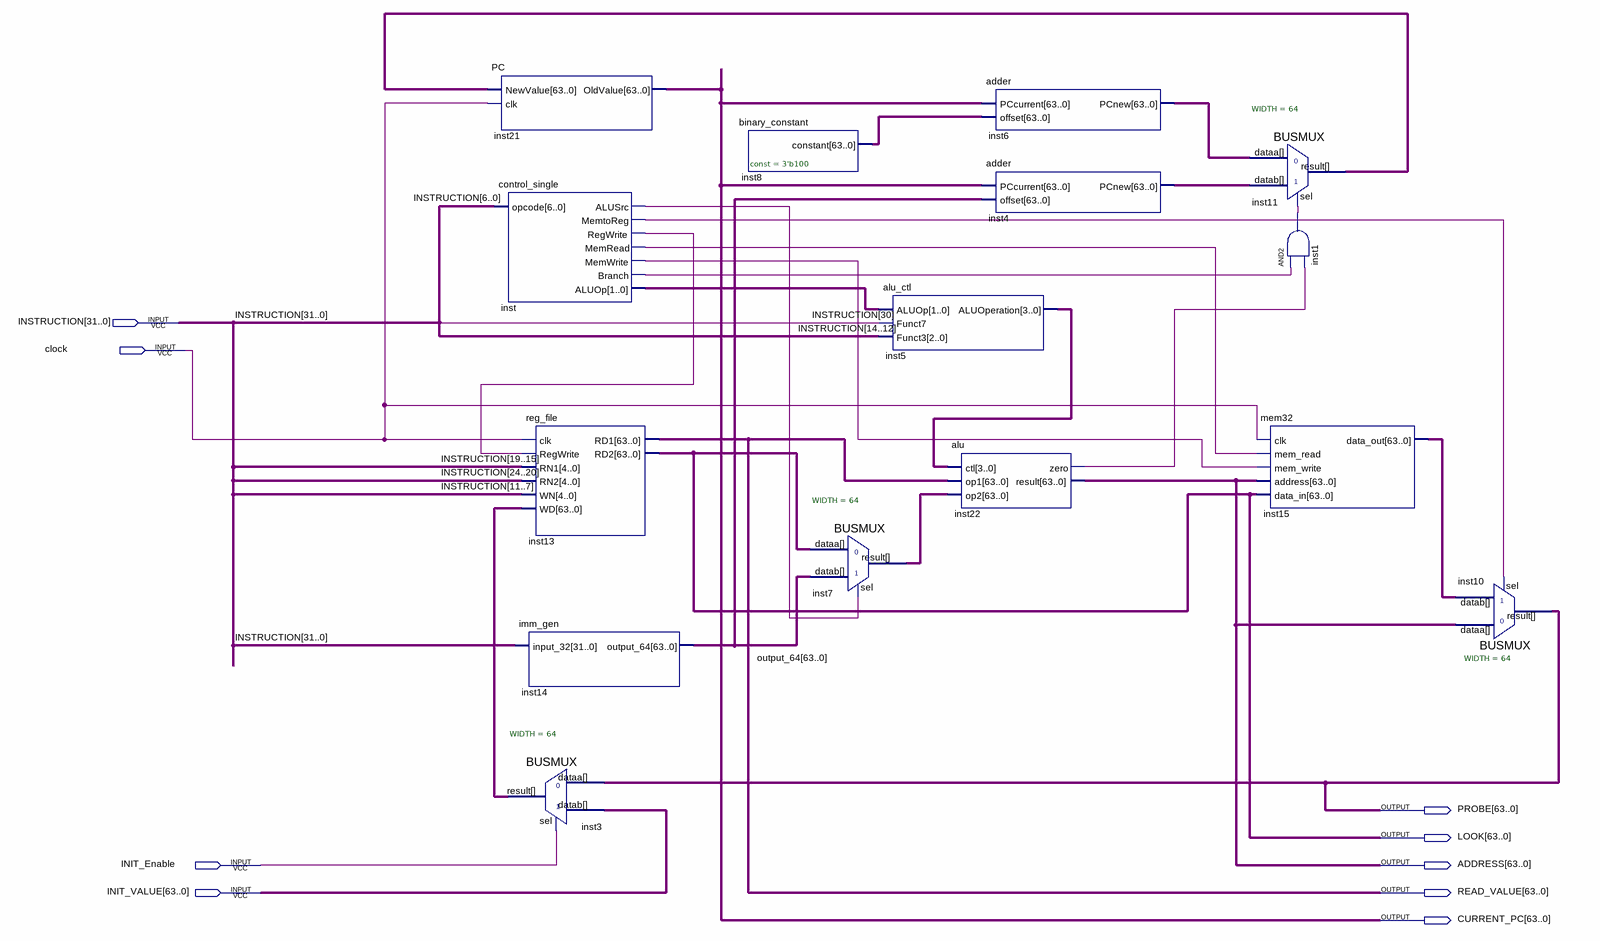
[diagram p0: schematic sheet]
// Quartus schematic top_level_KMC.bdf as structural Verilog: 15 symbols, 9 pins
module top_level_KMC (
  input  [31:0] INSTRUCTION,
  input  clock,
  input  INIT_Enable,
  input  [63:0] INIT_VALUE,
  output [63:0] PROBE,
  output [63:0] LOOK,
  output [63:0] ADDRESS,
  output [63:0] READ_VALUE,
  output [63:0] CURRENT_PC
);

  wire inst1_out, inst22_zero, inst_alusrc, inst_branch, inst_memread, inst_memtoreg, inst_memwrite,
       inst_regwrite;
  wire [1:0] inst_aluop;
  wire [3:0] inst5_aluoperation;
  wire [63:0] inst3_result, inst4_pcnew, inst6_pcnew, inst7_result, inst8_constant, inst11_result,
       inst15_data_out, output_64;

  PC inst21 (.NewValue(inst11_result), .clk(clock), .OldValue(CURRENT_PC));
  control_single inst (
    .opcode(INSTRUCTION[6:0]), .ALUSrc(inst_alusrc), .MemtoReg(inst_memtoreg), .RegWrite(inst_regwrite),
    .MemRead(inst_memread), .MemWrite(inst_memwrite), .Branch(inst_branch), .ALUOp(inst_aluop));
  reg_file inst13 (
    .clk(clock), .RegWrite(inst_regwrite), .RN1(INSTRUCTION[19:15]), .RN2(INSTRUCTION[24:20]),
    .WN(INSTRUCTION[11:7]), .WD(inst3_result), .RD1(READ_VALUE), .RD2(LOOK));
  imm_gen inst14 (.input_32(INSTRUCTION), .output_64(output_64));
  BUSMUX #(.WIDTH(64)) inst3 (.datab(INIT_VALUE), .sel(INIT_Enable), .dataa(PROBE), .result(inst3_result));
  binary_constant #(.\const (3'b100)) inst8 (.constant(inst8_constant));
  BUSMUX #(.WIDTH(64)) inst7 (.datab(output_64), .sel(inst_alusrc), .dataa(LOOK), .result(inst7_result));
  alu_ctl inst5 (
    .ALUOp(inst_aluop), .Funct7(INSTRUCTION[30]), .Funct3(INSTRUCTION[14:12]),
    .ALUOperation(inst5_aluoperation));
  alu inst22 (.ctl(inst5_aluoperation), .op1(READ_VALUE), .op2(inst7_result), .zero(inst22_zero), .result(ADDRESS));
  adder inst6 (.PCcurrent(CURRENT_PC), .offset(inst8_constant), .PCnew(inst6_pcnew));
  adder inst4 (.PCcurrent(CURRENT_PC), .offset(output_64), .PCnew(inst4_pcnew));
  BUSMUX #(.WIDTH(64)) inst11 (.datab(inst4_pcnew), .sel(inst1_out), .dataa(inst6_pcnew), .result(inst11_result));
  and inst1 (inst1_out, inst_branch, inst22_zero);
  mem32 inst15 (
    .clk(clock), .mem_read(inst_memread), .mem_write(inst_memwrite), .address(ADDRESS), .data_in(LOOK),
    .data_out(inst15_data_out));
  BUSMUX #(.WIDTH(64)) inst10 (.datab(inst15_data_out), .sel(inst_memtoreg), .dataa(ADDRESS), .result(PROBE));
endmodule
